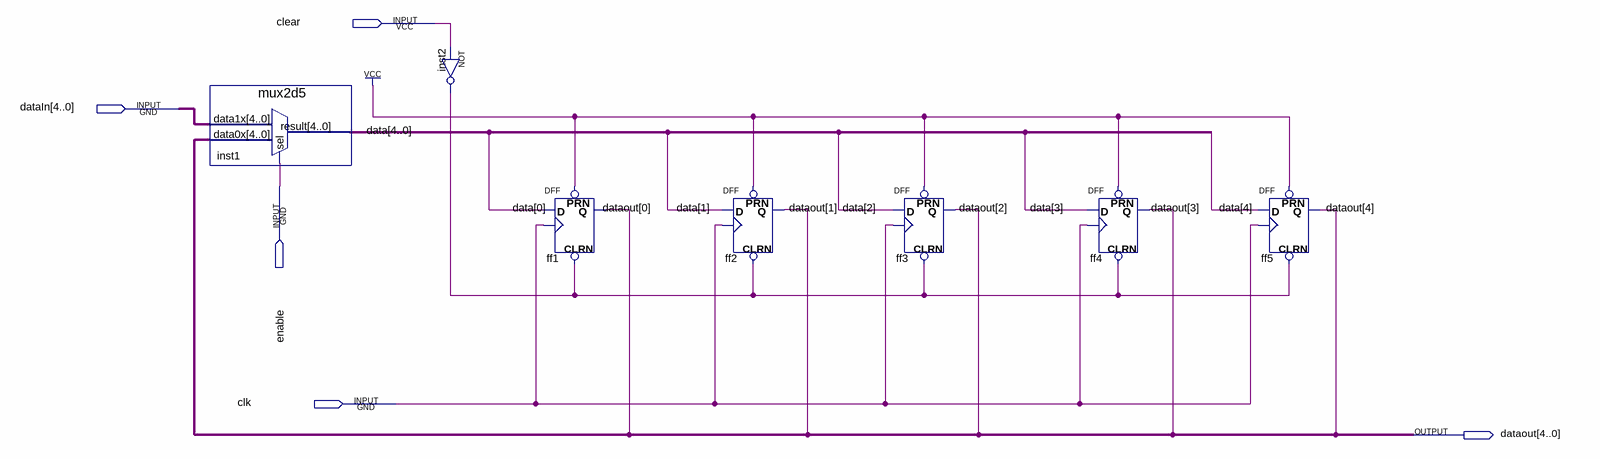
[diagram p0: schematic sheet]
// Quartus schematic register5clear.bdf as structural Verilog: 7 symbols, 5 pins
module register5clear (
  input  clear,
  input  [4:0] dataIn,
  input  enable,
  input  clk,
  output [4:0] dataout
);

  wire inst2_out;
  wire [4:0] data;

  mux2d5 inst1 (.data1x(dataIn), .data0x(dataout), .sel(enable), .result(data));
  not inst2 (inst2_out, clear);
  DFF ff1 (.CLRN(inst2_out), .CLK(clk), .D(data[0]), .PRN(1'b1), .Q(dataout[0]));
  DFF ff2 (.CLRN(inst2_out), .CLK(clk), .D(data[1]), .PRN(1'b1), .Q(dataout[1]));
  DFF ff3 (.CLRN(inst2_out), .CLK(clk), .D(data[2]), .PRN(1'b1), .Q(dataout[2]));
  DFF ff4 (.CLRN(inst2_out), .CLK(clk), .D(data[3]), .PRN(1'b1), .Q(dataout[3]));
  DFF ff5 (.CLRN(inst2_out), .CLK(clk), .D(data[4]), .PRN(1'b1), .Q(dataout[4]));
endmodule
